# Altium schematic sheet Altium-Sheet_1_2023-12-20.schdoc
size 297 x 97 mm
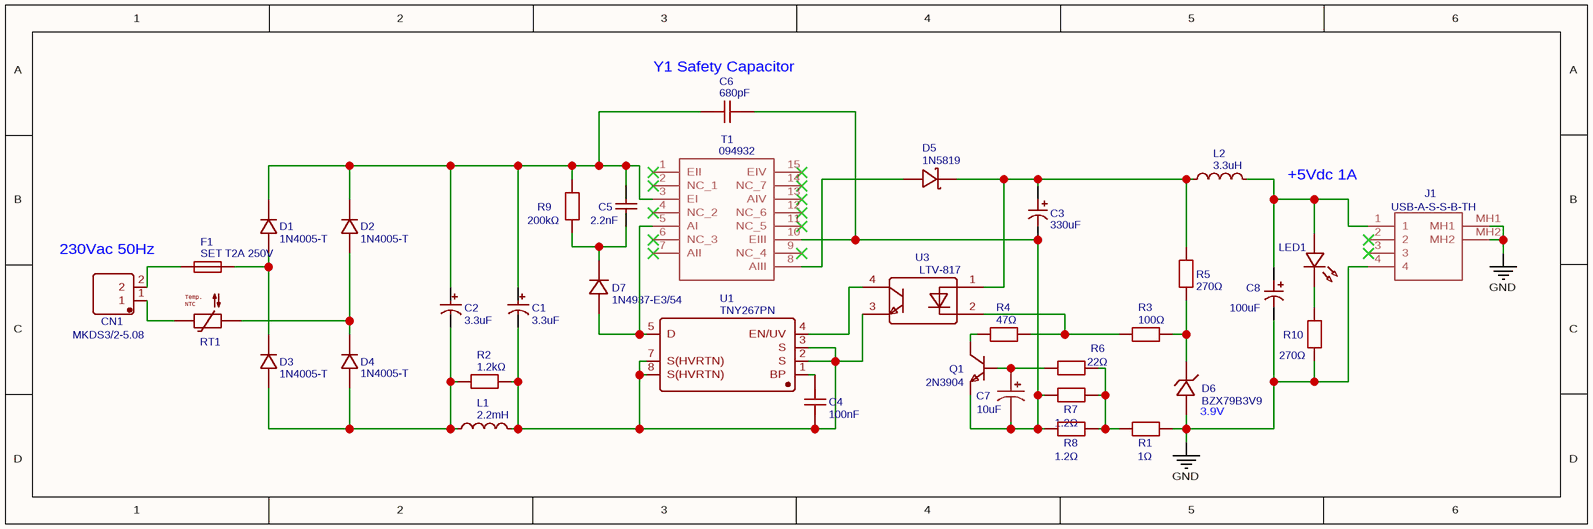
[diagram p0: Altium-Sheet_1_2023-12-20.schdoc]

## Parts
C1  3.3uF  [CAP-TH_BD8.0-P3.50-D0.6-FD]
C2  3.3uF  [CAP-TH_BD8.0-P3.50-D0.6-FD]
C3  330uF  [CAP-TH_BD10.0-P5.00-D0.6-FD]
C4  100nF  [CAP-TH_L5.8-W3.6-P5.0-D0.6]
C5  2.2nF  [CAP-TH_L18.0-W8.5-P15.00-D1.2]
C6  680pF  [CAP-TH_L12.0-W7.0-P10.00-D0.6]
C7  10uF  [CAP-TH_BD4.0-P1.50-D0.8-FD]
C8  100uF  [CAP-TH_BD6.3-P2.50-D1.0-FD]
CN1  MKDS3/2-5.08  [CONN-TH_MKDS3-2-5.08]
D1  1N4005-T  [DO-41_BD2.4-L4.7-P8.70-D0.9-RD]
D2  1N4005-T  [DO-41_BD2.4-L4.7-P8.70-D0.9-RD]
D3  1N4005-T  [DO-41_BD2.4-L4.7-P8.70-D0.9-RD]
D4  1N4005-T  [DO-41_BD2.4-L4.7-P8.70-D0.9-RD]
D5  1N5819  [DO-41_BD2.4-L4.7-P8.70-D0.9-FD]
D6  BZX79B3V9  [DO-41_BD2.4-L4.7-P8.70-D0.9-RD]
D7  1N4937-E3/54  [DO-41_BD2.4-L4.7-P8.70-D0.9-FD]
F1  SET T2A 250V  [FUSE-TH_L8.5-W4.0-P5.08-D0.6]
J1  USB-A-S-S-B-TH  [USBASSBTH]
L1  2.2mH  [IND-TH_BD9.5-P5.20-D0.6]
L2  3.3uH  [IND-TH_BD12.5-P6.00-D0.7]
LED1  LED-TH-5mm_WHT  [LED-TH-5MM_WHT]  (value not drawn)
Q1  2N3904  [TO-92-3_L4.6-W3.6-P1.30-L_2N3904]
R1  1Ω  [RES-TH_BD2.4-L6.4-P11.12-D0.6]
R2  1.2kΩ  [RES-TH_BD4.5-L11.0-P15.00-D0.7]
R3  100Ω  [RES-TH_BD2.7-L6.2-P10.20-D0.4]
R4  47Ω  [RES-TH_BD2.7-L6.2-P10.20-D0.4]
R5  270Ω  [RES-TH_BD2.7-L6.2-P10.20-D0.4]
R6  22Ω  [RES-TH_BD2.7-L6.2-P10.20-D0.4]
R7  1.2Ω  [RES-TH_BD2.4-L6.3-P10.30-D0.6]
R8  1.2Ω  [RES-TH_BD2.4-L6.3-P10.30-D0.6]
R9  200kΩ  [RES-TH_BD3.5-L9.0-P13.00-D0.5]
R10  270Ω  [RES-TH_BD2.7-L6.2-P10.20-D0.4]
RT1  NO  [AMPHENOL CL-120]  (value not drawn)
T1  094932  [094932]
U1  TNY267PN  [DIP-8_7P-L9.7-W6.4-P2.54-LS7.6-BL-PE6]
U3  LTV-817  [DIP-4_L4.6-W6.5-P2.54-LS7.6-BL]

## Nets
GND: C8.2 D6.2(A) J1.4 J1.MH1 J1.MH2 R1.2 R10.2
NetC1_1: C1.1 C2.1 C5.2 C6.1 D1.1 D2.1 R9.1 T1.3(EI)
NetC1_2: C1.2 C4.1 L1.2 R2.2 U1.2(S) U1.3(S) U1.7(S(HVRTN)) U1.8(S(HVRTN)) U3.3
NetC2_2: C2.2 D3.2 D4.2 L1.1 R2.1
NetC3_1: C3.1 D5.2(K) L2.1 R5.1 U3.1
NetC3_2: C3.2 C6.2 C7.2 Q1.1(E) R7.1 R8.1 T1.10(EIII)
NetC4_2: C4.2 U1.1(BP)
NetC5_1: C5.1 D7.2(K) R9.2
NetC7_1: C7.1 Q1.2(B) R6.1
NetC8_1: C8.1 J1.1 L2.2 LED1.1
NetCN1_1: CN1.1 RT1.1
NetCN1_2: CN1.2 F1.1
NetD1_2: D1.2 D3.1 F1.2
NetD2_2: D2.2 D4.1 RT1.2
NetD5_1: D5.1(A) T1.8(AIII)
NetD6_1: D6.1(C) R3.2 R5.2
NetD7_1: D7.1(A) T1.5(AI) U1.5(D)
NetLED1_2: LED1.2 R10.1
NetQ1_3: Q1.3(C) R4.2
NetR1_1: R1.1 R6.2 R7.2 R8.2
NetR3_1: R3.1 R4.1 U3.2
NetU1_4: U1.4(EN/UV) U3.4

Not connected (* = marked no-connect by the designer): J1 2* 3*; T1 1(EII)* 2(NC_1)* 4(NC_2)* 6(NC_3)* 7(AII)* 9(NC_4)* 11(NC_5)* 12(NC_6)* 13(AIV)* 14(NC_7)* 15(EIV)*

## Notes on the sheet
- (near C6) Y1 Safety Capacitor
- +5Vdc 1A
- (near CN1) 230Vac 50Hz
- (near D6) 3.9V
- (in symbol NO) Temp.; NTC

## Library data of the parts
C1 C2 = 3.3uF: Manufacturer: CX(承兴); Manufacturer Part: KM335M400F12RR0VH2FP0; nameAlias: Value; Supplier: LCSC; Supplier Part: C28888; JLCPCB Part Class: Extended Part; link: https://lcsc.com/eda_search?q=C28888&%26type=1&ref=editor; spicePre: C; spiceSymbolName: 3.3uF/400v
C3 = 330uF: Manufacturer: PANASONIC(松下); Manufacturer Part: EEU-FM1V331; nameAlias: Value; Contributor: lcsc; Supplier: LCSC; Supplier Part: C1579350; JLCPCB Part Class: Extended Part; link: https://lcsc.com/eda_search?q=C1579350&%26type=1&ref=editor; spicePre: C; spiceSymbolName: EEU-FM1V331
C4 = 100nF: Manufacturer: KNSCHA(科尼盛); Manufacturer Part: 178MU0002; nameAlias: Value; Contributor: lcsc; Supplier: LCSC; Supplier Part: C5632426; JLCPCB Part Class: Extended Part; link: https://lcsc.com/eda_search?q=C5632426&%26type=1&ref=editor; spicePre: C; spiceSymbolName: 178MU0002
C5 = 2.2nF: nameAlias: Value; Supplier: LCSC; JLCPCB Part Class: Extended Part; link: https://lcsc.com/eda_search?q=C105730&%26type=1&ref=editor; spicePre: C; spiceSymbolName: MP1224KTD4RLC
C6 = 680pF: Manufacturer: VISHAY(威世); Manufacturer Part: AY1222M47Y5UC63L0; Contributor: LCSC; nameAlias: Value; Supplier: LCSC; Supplier Part: C1620433; JLCPCB Part Class: Extended Part; link: https://lcsc.com/eda_search?q=C1620433&%26type=1&ref=editor; spicePre: C; spiceSymbolName: AY1222M47Y5UC63L0
C7 = 10uF: Manufacturer: rubycon(红宝石); Manufacturer Part: 10MS510MEFC4X5; Contributor: lcsc; nameAlias: Value; Supplier: LCSC; Supplier Part: C1579578; JLCPCB Part Class: Extended Part; link: https://lcsc.com/eda_search?q=C1579578&%26type=1&ref=editor; spicePre: U; spiceSymbolName: 10MS510MEFC4X5
C8 = 100uF: Manufacturer: ELNA(伊娜); Manufacturer Part: RFO-25V101MF3P#-T58; Contributor: lcsc; nameAlias: Value; Supplier: LCSC; Supplier Part: C399647; JLCPCB Part Class: Extended Part; link: https://lcsc.com/eda_search?q=C399647&%26type=1&ref=editor; spicePre: U; spiceSymbolName: RFO-25V101MF3P#-T58
CN1 = MKDS3/2-5.08: Manufacturer: Phoenix Contact(菲尼克斯); Manufacturer Part: 1711725; Supplier: LCSC; Supplier Part: C89120; JLCPCB Part Class: Extended Part; link: https://lcsc.com/eda_search?q=C89120&%26type=1&ref=editor; spicePre: C; spiceSymbolName: MKDS3/2-5.08
D1-D4 = 1N4005-T: Manufacturer: DIODES(美台); Contributor: LCSC; Supplier: LCSC; Supplier Part: C211377; Manufacturer Part: 1N4005-T; JLCPCB Part Class: Extended Part; link: https://lcsc.com/eda_search?q=C211377&%26type=1&ref=editor; spicePre: D; spiceSymbolName: 1N4005-T
D5 = 1N5819: Manufacturer: ST(意法半导体); Supplier: LCSC; Manufacturer Part: 1N5819; Supplier Part: C110032; JLCPCB Part Class: Extended Part; link: https://lcsc.com/eda_search?q=C110032&%26type=1&ref=editor; spicePre: D; spiceSymbolName: 1N5819
D6 = BZX79B3V9: Manufacturer: onsemi(安森美); Manufacturer Part: 1N5921BG; Contributor: LCSC; Supplier: LCSC; Supplier Part: C232466; JLCPCB Part Class: Extended Part; link: https://lcsc.com/eda_search?q=C232466&%26type=1&ref=editor; spicePre: D; spiceSymbolName: 1N5921BG
D7 = 1N4937-E3/54: Manufacturer: VISHAY(威世); Contributor: LCSC; Supplier: LCSC; Manufacturer Part: 1N4937-E3/54; Supplier Part: C113449; JLCPCB Part Class: Extended Part; link: https://lcsc.com/eda_search?q=C113449&%26type=1&ref=editor; spicePre: D; spiceSymbolName: 1N4937-E3/54
F1 = SET T2A 250V: Manufacturer: CHEVRON(诚润电子）; Contributor: lcsc; Supplier: LCSC; Supplier Part: C2839763; Manufacturer Part: SET T2A 250V; JLCPCB Part Class: Extended Part; link: https://lcsc.com/eda_search?q=C2839763&%26type=1&ref=editor; spicePre: F; spiceSymbolName: SET T2A 250V
J1 = USB-A-S-S-B-TH: Contributor: andreafato; spicePre: J; spiceSymbolName: USB-A-S-S-B-TH
L1 = 2.2mH: Manufacturer: PROD(谱罗德); Manufacturer Part: PDPTAT0810-222K; Contributor: lcsc; nameAlias: Value; Supplier: LCSC; Supplier Part: C2924240; JLCPCB Part Class: Extended Part; link: https://lcsc.com/eda_search?q=C2924240&%26type=1&ref=editor; spicePre: U; spiceSymbolName: PDPTAT0810-222K
L2 = 3.3uH: Manufacturer Part: VLU1012-3R3MB; nameAlias: Value; Contributor: LCSC; Supplier: LCSC; Supplier Part: DR0810-332L; JLCPCB Part Class: Extended Part; link: https://lcsc.com/eda_search?q=C142460&%26type=1&ref=editor; spicePre: L; spiceSymbolName: VLU1012-3R3MB
LED1 = LED-TH-5mm_WHT: Contributor: LCEDA_Lib; Supplier: LCSC; spicePre: L; spiceSymbolName: LED-TH-5mm_WHT
Q1 = 2N3904: Manufacturer: JSMSEMI(杰盛微); Contributor: LCSC; Supplier: LCSC; Supplier Part: C2874602; Manufacturer Part: 2N3904; JLCPCB Part Class: Extended Part; link: https://lcsc.com/eda_search?q=C2874602&%26type=1&ref=editor; spicePre: Q; spiceSymbolName: 2N3904_C2874602
R1 = 1Ω: Manufacturer: Tyohm(幸亚电阻); Manufacturer Part: RN1/2WS1RFT/B; Contributor: lcsc; nameAlias: Value; Supplier: LCSC; Supplier Part: C5200406; JLCPCB Part Class: Extended Part; link: https://lcsc.com/eda_search?q=C5200406&%26type=1&ref=editor; spicePre: R; spiceSymbolName: RN1/2WS1RFT/B
R2 = 1.2kΩ: Manufacturer: VO(翔胜); Manufacturer Part: CR1W-1K2±5%-6T63; Contributor: lcsc; nameAlias: Value; Supplier: LCSC; Supplier Part: C2897128; JLCPCB Part Class: Extended Part; link: https://lcsc.com/eda_search?q=C2897128&%26type=1&ref=editor; spicePre: R; spiceSymbolName: CR1W-1K2±5%-6T63
R3 = 100Ω: Manufacturer: VO(翔胜); Manufacturer Part: CR1/4W-100Ω±5%-ST52; Contributor: lcsc; nameAlias: Value; Supplier: LCSC; Supplier Part: C2894648; JLCPCB Part Class: Extended Part; link: https://lcsc.com/eda_search?q=C2894648&%26type=1&ref=editor; spicePre: R; spiceSymbolName: CR1/4W-100Ω±5%-ST52
R4 = 47Ω: Manufacturer: VO(翔胜); Manufacturer Part: CR1/4W-100Ω±5%-ST52; Contributor: lcsc; nameAlias: Value; Supplier: LCSC; Supplier Part: C2894648; JLCPCB Part Class: Extended Part; link: https://lcsc.com/eda_search?q=C2894648&%26type=1&ref=editor; spicePre: R; spiceSymbolName: CR1/4W-100Ω±5%-ST52
R5 R10 = 270Ω: Manufacturer: VO(翔胜); Manufacturer Part: CR1/4W-100Ω±5%-ST52; Contributor: lcsc; nameAlias: Value; Supplier: LCSC; Supplier Part: C2894648; JLCPCB Part Class: Extended Part; link: https://lcsc.com/eda_search?q=C2894648&%26type=1&ref=editor; spicePre: R; spiceSymbolName: CR1/4W-100Ω±5%-ST52
R6 = 22Ω: Manufacturer: VO(翔胜); Manufacturer Part: CR1/4W-100Ω±5%-ST52; Contributor: lcsc; nameAlias: Value; Supplier: LCSC; Supplier Part: C2894648; JLCPCB Part Class: Extended Part; link: https://lcsc.com/eda_search?q=C2894648&%26type=1&ref=editor; spicePre: R; spiceSymbolName: CR1/4W-100Ω±5%-ST52
R7 R8 = 1.2Ω: Manufacturer: YAGEO(国巨); Manufacturer Part: MFR50SFTE52-1R21; Contributor: lcsc; nameAlias: Value; Supplier: LCSC; Supplier Part: C1378155; link: https://lcsc.com/eda_search?q=C1378155&%26type=1&ref=editor; spicePre: U; spiceSymbolName: MFR50SFTE52-1R21
R9 = 200kΩ: Manufacturer: VO(翔胜); Manufacturer Part: CR1/2W-220K±5%-XT52; Contributor: lcsc; nameAlias: Value; Supplier: LCSC; Supplier Part: C2894491; JLCPCB Part Class: Extended Part; link: https://lcsc.com/eda_search?q=C2894491&%26type=1&ref=editor; spicePre: U; spiceSymbolName: CR1/2W-220K±5%-XT52
RT1 = NO: Manufacturer Part: CL-120; Manufacturer: Amphenol Advanced Sensors; Contributor: Xperia BlueStacks; license: https://www.gnu.org/licenses/lgpl-2.1.html; Supplier: Digi-Key; Supplier Part: KC012L-ND; link: https://www.digikey.at/product-detail/de/amphenol-advanced-sensors/CL-120/KC012L-ND/50525; spicePre: R; spiceSymbolName: AMPHENOL CL-120
T1 = 094932: Contributor: andreafato; spicePre: T; spiceSymbolName: 094932
U1 = TNY267PN: Manufacturer: Power Integrations(帕沃英蒂格盛); Supplier: LCSC; Manufacturer Part: TNY267PN; Supplier Part: C48062; JLCPCB Part Class: Extended Part; link: https://lcsc.com/eda_search?q=C48062&%26type=1&ref=editor; spicePre: U; spiceSymbolName: TNY267PN
U3 = LTV-817: Manufacturer: LITEON(光宝); Contributor: LCSC; Supplier: LCSC; Supplier Part: C125120; Manufacturer Part: LTV-817; JLCPCB Part Class: Extended Part; link: https://lcsc.com/eda_search?q=C125120&%26type=1&ref=editor; spicePre: U; spiceSymbolName: LTV-817